# EAGLE design Bluepill-V001 (EAGLE 8.5.0)
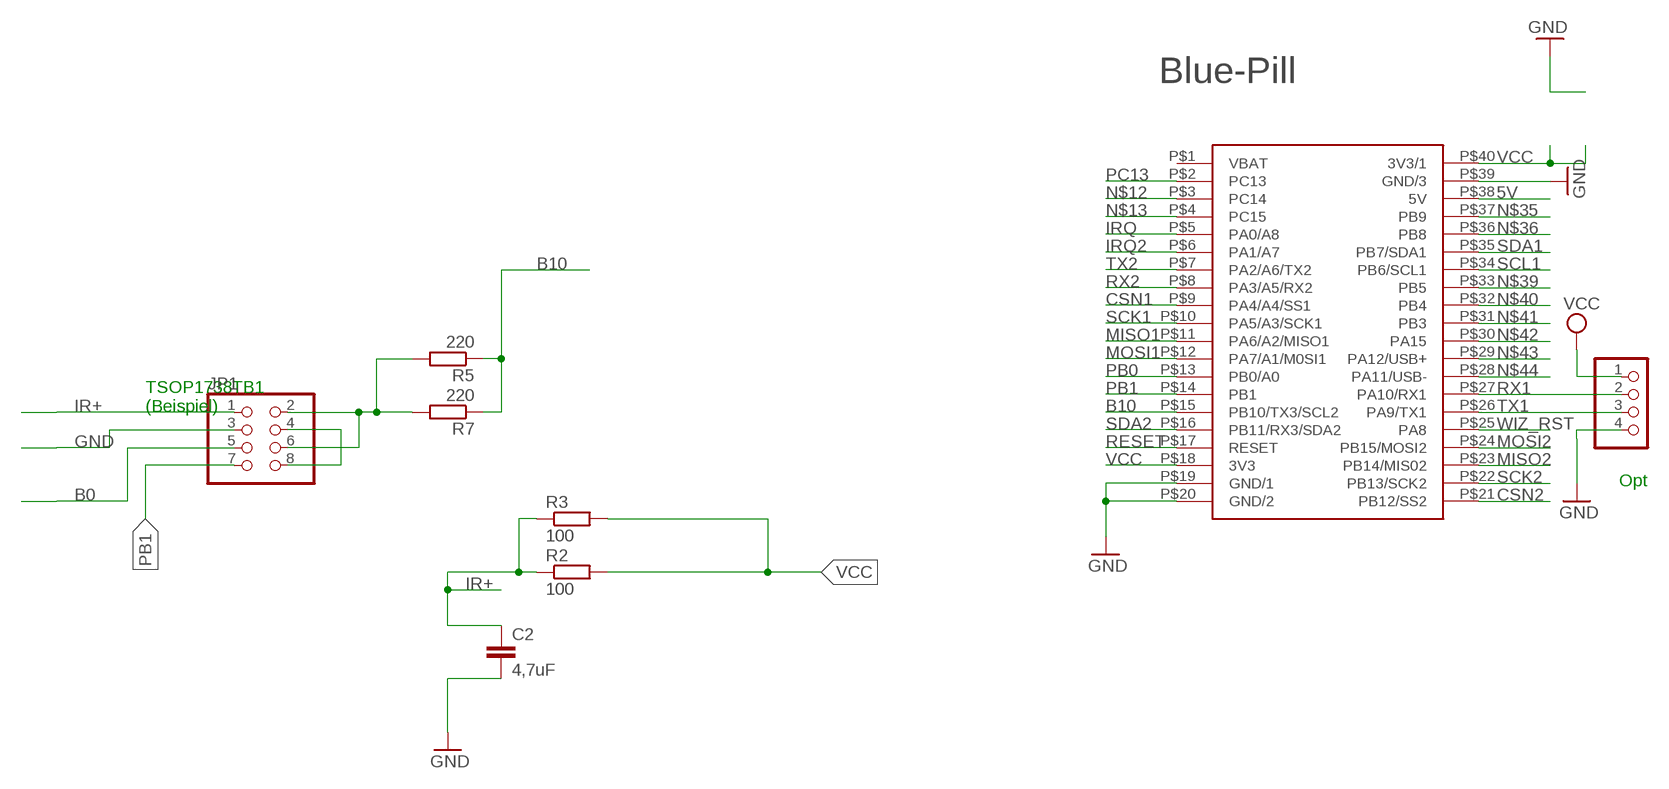
[diagram p0: schematic, sheet 1]

## Parts
C2  4,7uF  C-EUC1206K  [C1206K]
DBG  PINHD-1X04_2.54-S  [1X04-S]
JP1  PINHD-2X4/90  [2X04/90]
R2  100  R-EU_0204/7  [0204/7]
R3  100  R-EU_R0805W  [R0805W]
R5  220  R-EU_0204/7  [0204/7]
R7  220  R-EU_R0805W  [R0805W]
U$4  BLUEPILL  [BLUEPILL]

## Nets
5V [PWR]: U$4.P$38(5V)
B0: JP1.5
B10: R5.1 R7.1 U$4.P$15(PB10/TX3/SCL2)
CSN1: U$4.P$9(PA4/A4/SS1)
CSN2: U$4.P$21(PB12/SS2)
GND [PWR]: C2.2 DBG.4 JP1.3 U$4.P$19(GND/1) U$4.P$20(GND/2) U$4.P$39(GND/3)
IR+: C2.1 JP1.1 R2.1 R3.1
IRQ: U$4.P$5(PA0/A8)
IRQ2: U$4.P$6(PA1/A7)
MISO1: U$4.P$11(PA6/A2/MISO1)
MISO2: U$4.P$23(PB14/MIS02)
MOSI1: U$4.P$12(PA7/A1/M0SI1)
MOSI2: U$4.P$24(PB15/MOSI2)
N$2: JP1.4 JP1.8
N$3: JP1.2 JP1.6 R5.2 R7.2
N$12: U$4.P$3(PC14)
N$13: U$4.P$4(PC15)
N$35: U$4.P$37(PB9)
N$36: U$4.P$36(PB8)
N$39: U$4.P$33(PB5)
N$40: U$4.P$32(PB4)
N$41: U$4.P$31(PB3)
N$42: U$4.P$30(PA15)
N$43: U$4.P$29(PA12/USB+)
N$44: U$4.P$28(PA11/USB-)
PB0: U$4.P$13(PB0/A0)
PB1: JP1.7 U$4.P$14(PB1)
PC13: U$4.P$2(PC13)
RESET: U$4.P$17(RESET)
RX1: DBG.2 U$4.P$27(PA10/RX1)
RX2: U$4.P$8(PA3/A5/RX2)
SCK1: U$4.P$10(PA5/A3/SCK1)
SCK2: U$4.P$22(PB13/SCK2)
SCL1: U$4.P$34(PB6/SCL1)
SDA1: U$4.P$35(PB7/SDA1)
SDA2: U$4.P$16(PB11/RX3/SDA2)
TX1: DBG.3 U$4.P$26(PA9/TX1)
TX2: U$4.P$7(PA2/A6/TX2)
VCC [PWR]: DBG.1 R2.2 R3.2 U$4.P$18(3V3) U$4.P$40(3V3/1)
WIZ_RST: U$4.P$25(PA8)
Unconnected: U$4.P$1(VBAT)

## Notes on the sheet
- Blue-Pill
- TSOP1738TB1
  (Beispiel)
- Opt

## Library data of the parts
C2 = rcl:C-EU: CAPACITOR, European symbol
DBG = pinhead-2:PINHD-1X04: PIN HEADER
JP1 = pinhead:PINHD-2X4: PIN HEADER
R2 R3 R5 R7 = rcl:R-EU_: RESISTOR, European symbol
U$4 = stm32duino boards:BLUEPILL

## Net classes
0 default: width 0.254 mm, clearance 0.205 mm
1 PWR: width 0.406 mm, clearance 0.205 mm to class 0, clearance 0.205 mm

## Board
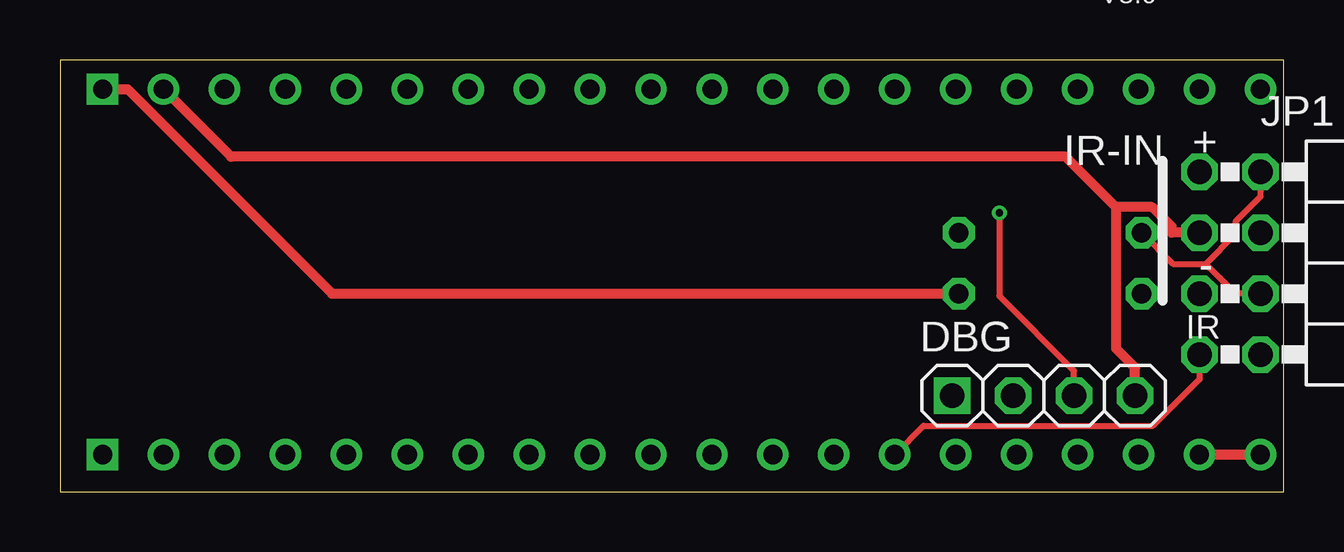
[diagram p1: board, top side]
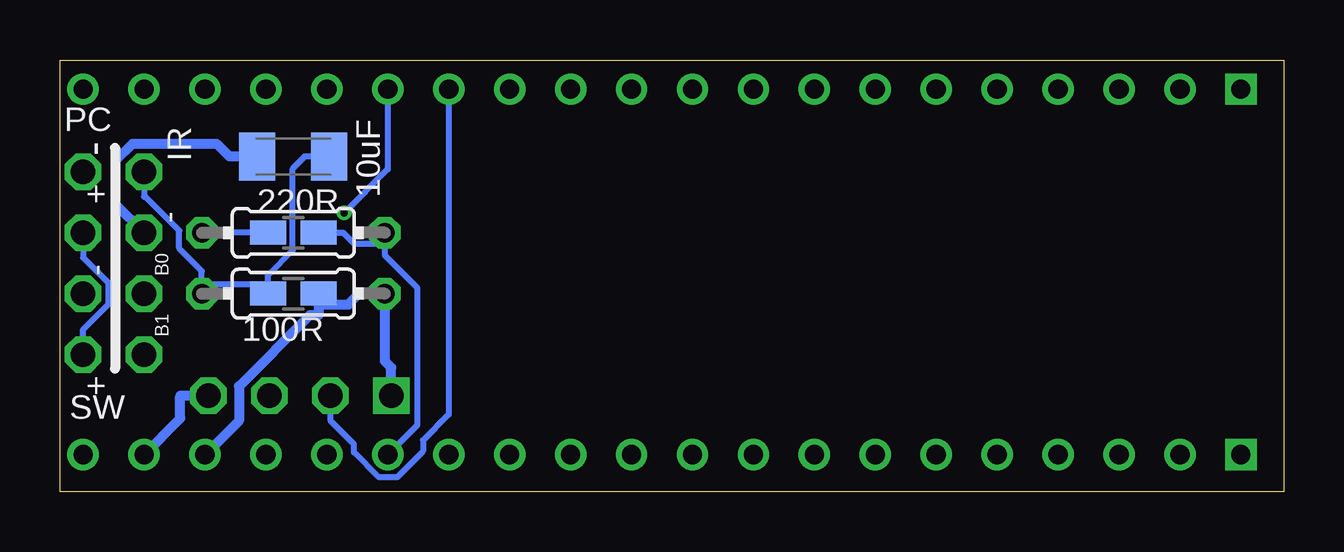
[diagram p2: board, bottom side, seen from below]

Size 51 x 18 mm. Coordinates in mm from the lower left corner, seen from the top.
Outline: 0,0 51,0 51,18 0,18 0,0
Copper layers (1*16): Top 0.035mm / dielectric 1.5mm / Bottom 0.035mm
Design rules "Fusion_eagle_rule_v1.1": minimum track width 6mil, minimum drill 12mil, track to track 6mil, track to pad 6mil, pad to pad 6mil, via to via 6mil, smd to smd 0mil, copper to edge 10mil, drill to drill 10mil, minimum pad ring 10mil, minimum via ring 6mil, stop-mask expansion 2mil, vias tented up to drill 100mil, thermal gap 10mil

### Footprints (pad centres in the part's own frame; a part is rotated, then mirrored left to right if it is on the bottom)
C1206K = smd 1.5 x 2: 1 -1.5,0; 2 1.5,0
1X04-S = drill 1.016 square: 1 -3.81,0 | drill 1.016 octagon: 2 -1.27,0; 3 1.27,0; 4 3.81,0
2X04/90 = drill 1.016 octagon: 1 -3.81,-6.35; 2 -3.81,-3.81; 3 -1.27,-6.35; 4 -1.27,-3.81; 5 1.27,-6.35; 6 1.27,-3.81; 7 3.81,-6.35; 8 3.81,-3.81
0204/7 = drill 0.813 octagon: 1 -3.81,0; 2 3.81,0
R0805W = smd 1.5 x 1: 1 -1.052,0; 2 1.052,0
BLUEPILL = drill 0.8 square: P$1 -7.62,22.86; P$40 7.62,22.86 | drill 0.8: P$2 -7.62,20.32; P$3 -7.62,17.78; P$4 -7.62,15.24; P$5 -7.62,12.7; P$6 -7.62,10.16; P$7 -7.62,7.62; P$8 -7.62,5.08; P$9 -7.62,2.54; P$10 -7.62,0; P$11 -7.62,-2.54; P$12 -7.62,-5.08; P$13 -7.62,-7.62; P$14 -7.62,-10.16; P$15 -7.62,-12.7; P$16 -7.62,-15.24; P$17 -7.62,-17.78; P$18 -7.62,-20.32; P$19 -7.62,-22.86; P$20 -7.62,-25.4; P$21 7.62,-25.4; P$22 7.62,-22.86; P$23 7.62,-20.32; P$24 7.62,-17.78; P$25 7.62,-15.24; P$26 7.62,-12.7; P$27 7.62,-10.16; P$28 7.62,-7.62; P$29 7.62,-5.08; P$30 7.62,-2.54; P$31 7.62,0; P$32 7.62,2.54; P$33 7.62,5.08; P$34 7.62,7.62; P$35 7.62,10.16; P$36 7.62,12.7; P$37 7.62,15.24; P$38 7.62,17.78; P$39 7.62,20.32

### Placement (x,y rotation side)
C2  41.27,13.97 180 bottom
DBG  41,4 0 top
JP1  53.84,9.53 270 top
R2  41.27,8.26 0 bottom
R3  41.27,8.26 0 bottom
R5  41.27,10.79 180 bottom
R7  41.27,10.79 180 bottom
U$4  24.64,9.16 90 top

### Tracks (layer width: path | path; a pad name or v marks a point on that pad's centre or on a via)
B10
  Bottom 0.254: R7.1 39.19,10.79 38.72,10.32 37.47,10.32 | 37.47,10.32 37.47,9.86 36.1,8.49 36.1,2.78 U$4.P$15 | R5.1 37.47,10.32
GND
  Top 0.406: 44.01,11.86 41.91,13.96 7.13,13.96 U$4.P$39 | 44.01,11.86 45.53,11.86 46.33,11.07 46.33,10.79 JP1.3 | 44.01,11.86 44.01,5.97 44.81,5.17 DBG.4 | U$4.P$20 U$4.P$19
  Bottom 0.406: C2.2 43.93,13.97 44.47,14.51 47.98,14.51 48.67,13.82 48.67,11.97 JP1.3 | DBG.4 45.98,4 45.98,3.06 U$4.P$19
IR+
  Bottom 0.254: 45.09,8.64 45.09,9.2 46.02,10.13 46.02,10.88 47.44,12.29 47.49,12.29 JP1.1 | R2.1 45.09,8.64 | 42.33,8.64 42.33,9.03 41.3,10.06 41.3,13.48 40.8,13.97 C2.1 | R3.1 42.33,8.64 | 42.33,8.64 45.09,8.64
N$2
  Bottom 0.254: JP1.8 50.03,6.76 48.99,7.8 48.99,8.71 50.03,9.75 JP1.4
N$3
  Top 0.254: 47.75,9.49 48.99,8.26 JP1.6 | R5.2 46.39,9.49 47.75,9.49 | 47.75,9.49 48.99,10.73 48.99,11.25 50.03,12.29 JP1.2
  Bottom 0.254: R7.2 R5.2
PB1
  Top 0.254: JP1.7 47.49,4.67 45.56,2.74 35.99,2.74 U$4.P$14
RX1
  Bottom 0.254: DBG.2 39.73,2.96 38.74,1.97 38.74,1.63 37.72,0.6 36.95,0.6 35.87,1.68 35.87,2.14 34.8,3.21 U$4.P$27
TX1  (via drill 0.3 pad 0.61)
  Top 0.254: DBG.3 42.27,5.04 39.15,8.16 v39.15,11.62
  Bottom 0.254: U$4.P$26 37.34,13.44 v39.15,11.62
VCC
  Top 0.406: U$4.P$40 2.84,16.78 2.84,16.75 11.34,8.26 R2.2
  Bottom 0.406: 40.22,7.8 38.99,7.8 38.53,8.26 R2.2 37.47,5.45 37.19,5.17 DBG.1 | 40.22,7.8 40.22,7.35 40.58,7.35 43.54,4.39 43.54,2.96 U$4.P$18 | R3.2 40.22,7.8

### Text on the board
tNames: STM32-IR-Small | V3.0 | IR-IN | + | - | IR
bNames: PC | IR | - | 10uF | 220R | + | - | B0 | - | 100R | B1 | + | SW
tValues: www.neuby.de